# EasyEDA Pro project ProDoc_DRV8701单驱2_2025-04-30.epro

# Schematic SCH-DRV8701E双驱_2
Board Name: DRV8701E双驱_1; Create Date: 2025-01-18; Page Name: P1; Project Name: DRV8701E双驱，曙光; Schematic Name: SCH-DRV8701E双驱_1; Update Date: 2025-01-18; Company: 嘉立创EDA; Page Size: A4; Version: V1.0
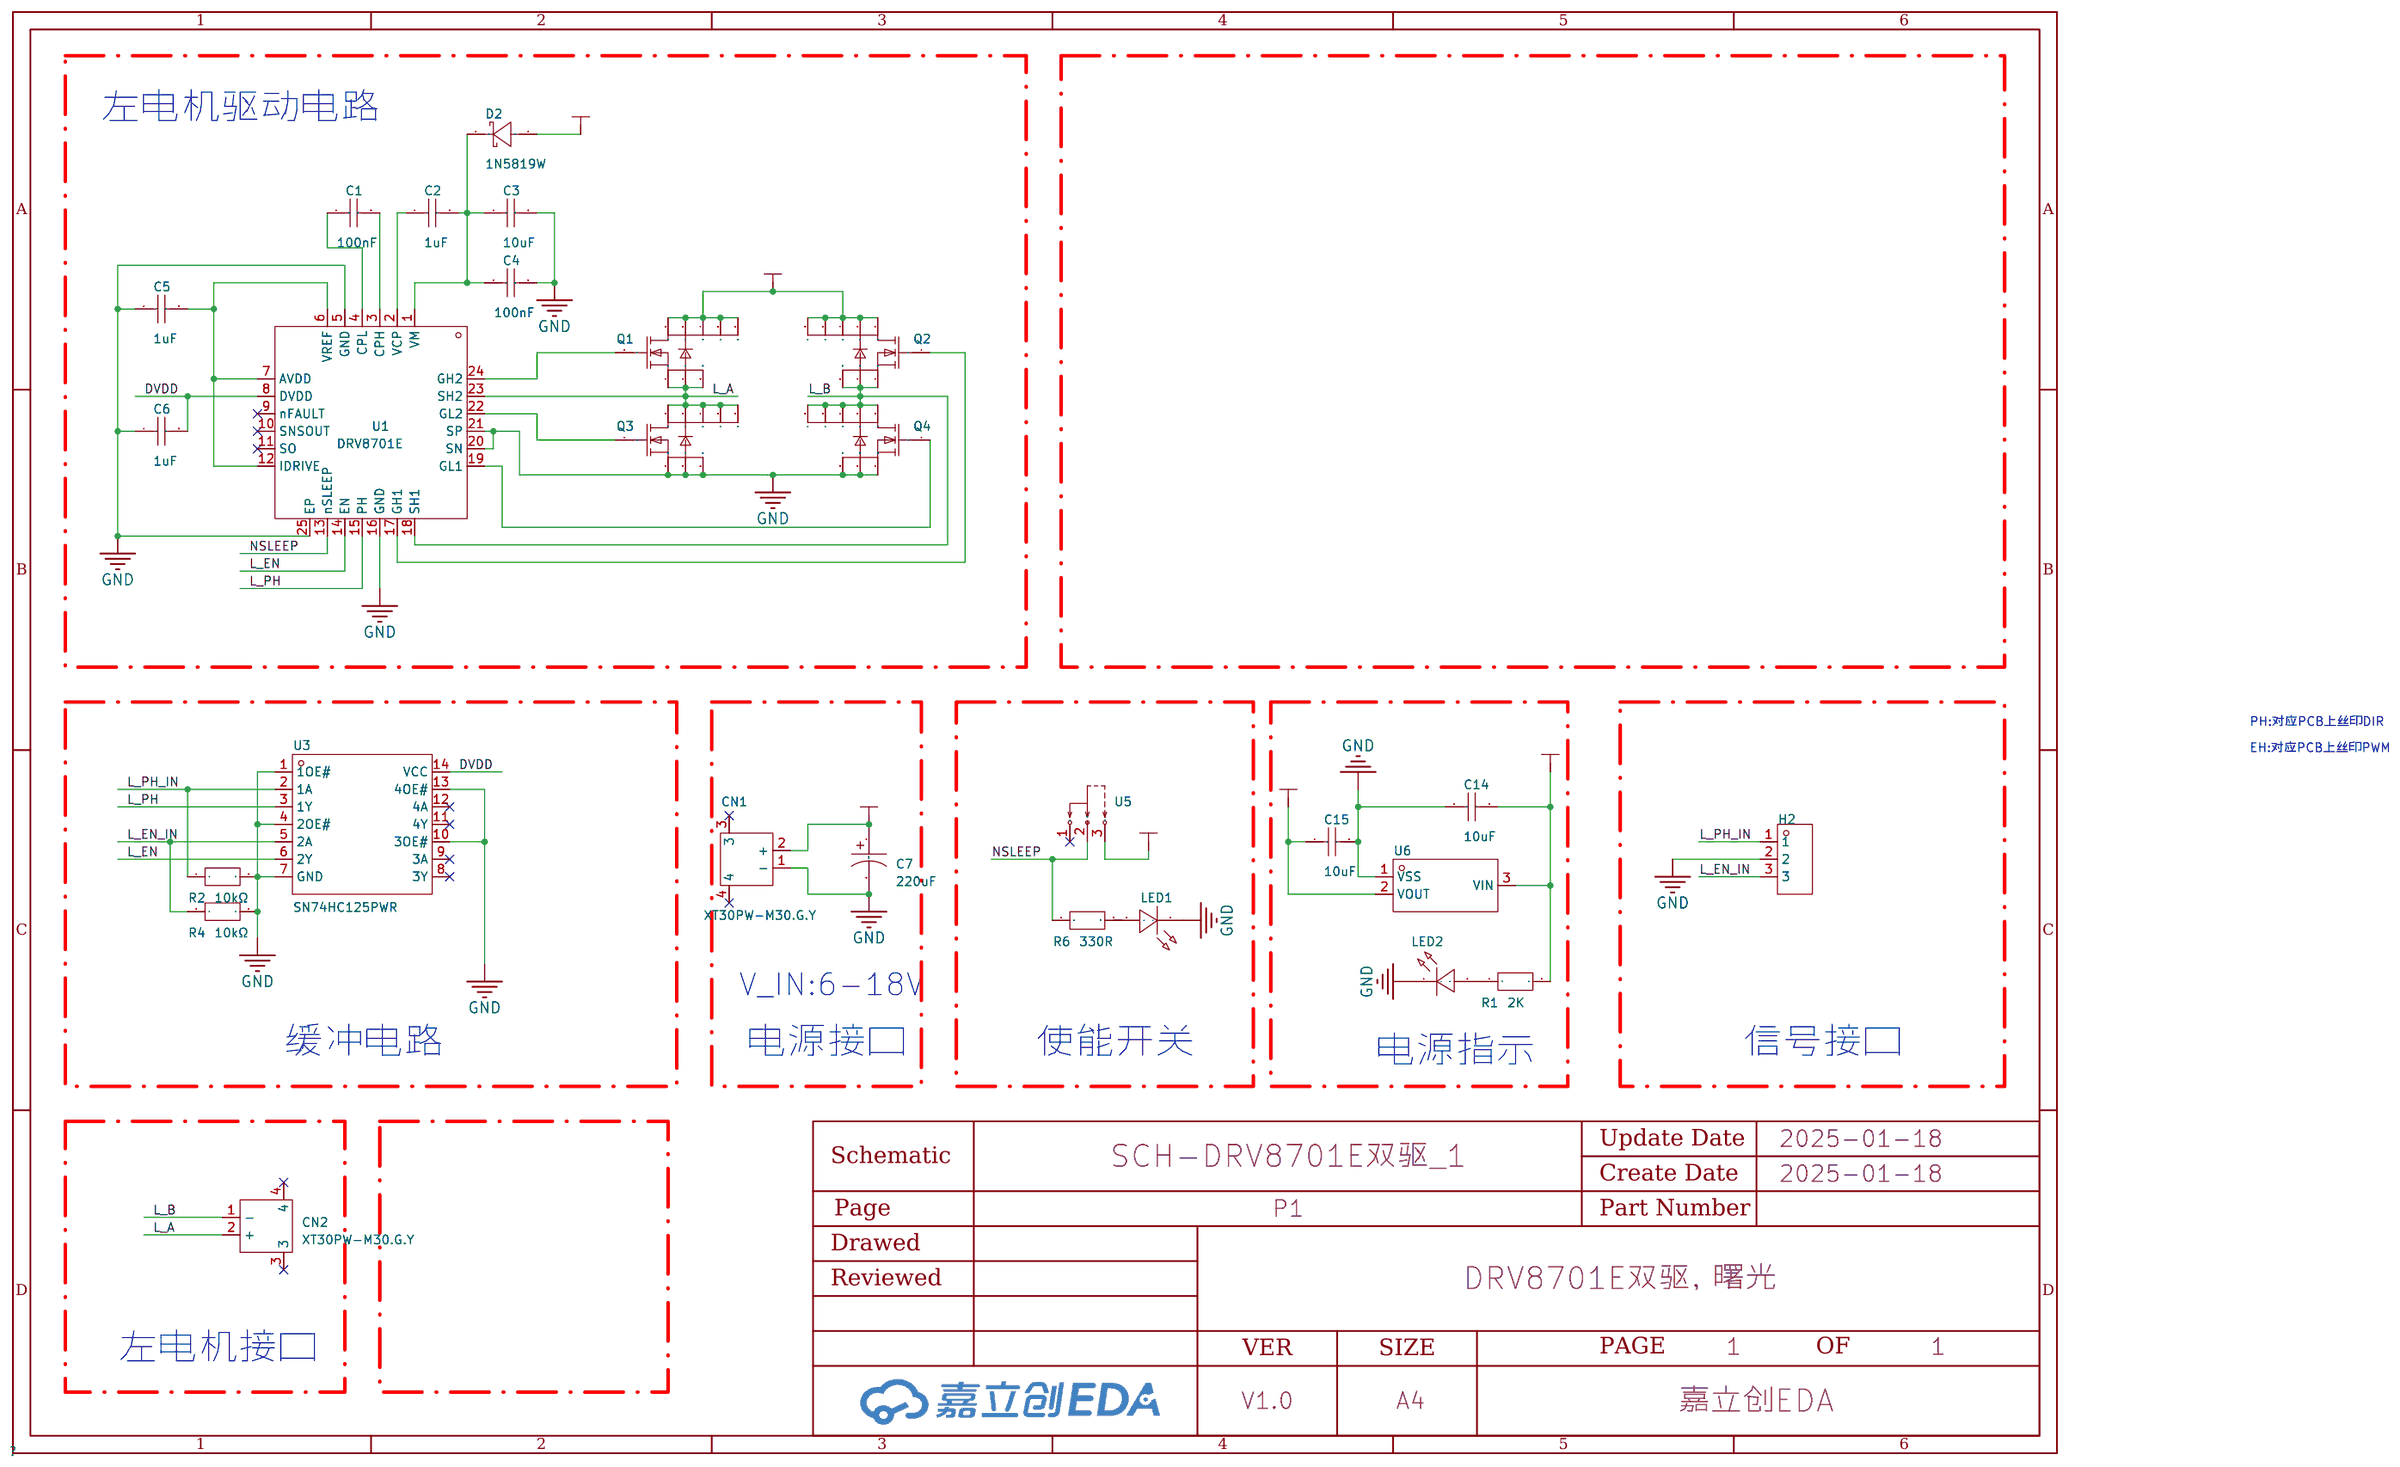
[diagram p0: schematic sheet]

## Parts
C1  100nF  [C0805]
C2  1uF  [C0805]
C3  10uF  [C0805]
C4  100nF  [C0805]
C5  1uF  [C0805]
C6  1uF  [C0805]
C7  220uF  [CAP-TH_BD8.0-P3.50-D0.6-FD]
C14  10uF  [C0805]
C15  10uF  [C0805]
CN1  XT30PW-M30.G.Y  [CONN-TH_XT30PW-M]
CN2  XT30PW-M30.G.Y  [CONN-TH_XT30PW-M]
D2  1N5819W  [SOD-123_L2.7-W1.6-LS3.7-R-RD]
H2  -  [HDR-TH_3P-P2.54-V-F]
LED1  P2-0805UVTCS2-0.8T  [LED0805-RD_PURPLE]
LED2  P2-0805UVTCS2-0.8T  [LED0805-RD_PURPLE]
Q1  TPH1R403NL,L1Q(M  [DSOP-8_L5.0-W5.0-P1.27-LS6.0-BL-EP]
Q2  TPH1R403NL,L1Q(M  [DSOP-8_L5.0-W5.0-P1.27-LS6.0-BL-EP]
Q3  TPH1R403NL,L1Q(M  [DSOP-8_L5.0-W5.0-P1.27-LS6.0-BL-EP]
Q4  TPH1R403NL,L1Q(M  [DSOP-8_L5.0-W5.0-P1.27-LS6.0-BL-EP]
R1  2K  [R0805]
R2  10kΩ  [R0805]
R4  10kΩ  [R0805]
R6  330R  [R0805]
U1  DRV8701E  [VQFN-24_L4.0-W4.0-P0.50-BL-EP2.5]
U3  SN74HC125PWR  [TSSOP-14_L5.0-W4.4-P0.65-LS6.5-BL]
U5  HX SS12D10G4  [SW-TH_SHOU-HAN_SS12D10G4]
U6  LR8341A-T33  [SOT-23-3L_L2.9-W1.6-P1.90-LS2.8-BL]

## Library data of the parts
C1-C6 C14 C15 = CL21B104KBCNNNC: 容值:100nF;精度:±10%;额定电压:50V;材质(温度系数):X7R;; LCSC Part Name: 100nF ±10% 50V; Supplier Part: C1711; Manufacturer: SAMSUNG(三星); Supplier Footprint: 0805; JLCPCB Part Class: Extended Part; Datasheet: https://atta.szlcsc.com/upload/public/pdf/source/20160103/1457707693305.pdf; Supplier: LCSC; Tolerance: ±10%; Voltage Rated: 50V; Temperature Coefficient: X7R
C7 = 25PZE220M8X9: 类型:混合物;容值:220uF;精度:±20%;额定电压:25V;电容体直径:8mm;电容体长度:9mm;脚间距:-;纹波电流:2.3A@100kHz;等效串联电阻:27mΩ@100kHz;工作寿命:10000hrs@105℃;工作温度:-55℃~+105℃;; LCSC Part Name: 220uF ±20% 25V; Supplier Part: C1578758; Manufacturer: rubycon(红宝石); Supplier Footprint: 径向引线,8x9mm; JLCPCB Part Class: Extended Part; Datasheet: https://atta.szlcsc.com/upload/public/pdf/source/20210510/C1578758_E2F1F56A0A42A1F170EC582F74BCA115.pdf; Supplier: LCSC; Type: 混合物; Tolerance: ±20%; Rated Voltage: 25V; φD: 8mm; L: 9mm; Ripple Current: 2.3A@100kHz; Equivalent Series Resistance(ESR): 27mΩ@100kHz; Lifetime @ Temp: 10000hrs@105℃; Operating Temperature: -55℃~+105℃
CN1 CN2 = XT30PW-M30.G.Y: 类别:-;类型1:-;; LCSC Part Name: AMASS(艾迈斯)航模插头 卧式弯脚 XT30PW-M公头; Supplier Part: C431092; Manufacturer: AMASS(艾迈斯); JLCPCB Part Class: 扩展库; Datasheet: https://atta.szlcsc.com/upload/public/pdf/source/20220222/6A9F22F7850E25B33E1BE430ADF8560B.pdf; Supplier: LCSC; Type: 航模插头; RatedVoltage: DC 500V; InterfaceType: 公头; RatedCurrent: 15A; RecommendedWireGauge: 16/18/20AWG; contact resistance: 1.2mΩ; specifications: 2pin
D2 = 1N5819W_C963381: 二极管配置:独立式;直流反向耐压(Vr):40V;平均整流电流(Io):350mA;正向压降(Vf):600mV@200mA;反向电流(Ir):5uA@30V;; LCSC Part Name: 40V 350mA 600mV@200mA; Supplier Part: C963381; Manufacturer: JSMSEMI(杰盛微); Supplier Footprint: SOD-123; JLCPCB Part Class: 扩展库; Datasheet: https://atta.szlcsc.com/upload/public/pdf/source/20211201/C266112E93E924DFE0C071C9A8E85281.pdf; Supplier: LCSC; Diode Configuration: 独立式; Reverse Voltage (Vr): 40V; Average Rectified Current (Io): 350mA; Forward Voltage (Vf@If): 600mV@200mA; Reverse Leakage Current (Ir): 5uA@30V
H2 = HDR-F_2.54_1x3P: Supplier Part: C541850; Supplier Footprint: 插件
LED1 LED2 = P2-0805UVTCS2-0.8T: 峰值波长:410nm~420nm;发光角度:120°;正向电压:3V;正向电流:30mA;功耗:90mW;工作温度:-40℃~+85℃;抗静电能力:2kV;辐射功率:-;; LCSC Part Name: 0805紫光0.8T; Supplier Part: C2827270; Manufacturer: TUOZHAN(拓展光电); Supplier Footprint: 0805; JLCPCB Part Class: 扩展库; Datasheet: https://atta.szlcsc.com/upload/public/pdf/source/20210423/C2827270_475A43B7F06EF651B4600F80B81B4A43.pdf; Supplier: LCSC; Peak Wavelength: 410nm~420nm; Viewing Angle: 120°; Forward Voltage: 3V; Forward Current: 30mA; Power Dissipation: 90mW; Operating Temperature: -40℃~+85℃; Antistatic Ability: 2kV
Q1-Q4 = TPH1R403NL,L1Q(M: Supplier Part: C2940403; Manufacturer: TOSHIBA(东芝); Supplier Footprint: SOP-8; Datasheet: https://atta.szlcsc.com/upload/public/pdf/source/20220830/C277A7BCA37DB7348B2C95BA2E6DA6BE.pdf; Supplier: LCSC
R1 R2 R4 R6 = ERJP06J103V: 阻值:10kΩ;精度:±5%;功率:500mW;温度系数:±200ppm/℃;最大工作电压:600V;工作温度范围:-55℃~+155℃;; LCSC Part Name: 10kΩ ±5% 500mW; Supplier Part: C441955; Manufacturer: PANASONIC(松下); Supplier Footprint: 0805; JLCPCB Part Class: Extended Part; Supplier: LCSC; Tolerance: ±5%; Power(Watts): 500mW; Temperature Coefficient: ±200ppm/℃; Overload Voltage (Max): 600V; Operating Temperature Range: -55℃~+155℃
U1 = DRV8701ERGET: 电源电压:0V~5.5V;输出电流:-;接口:并行;; Supplier Part: C132049; Manufacturer: TI(德州仪器); Supplier Footprint: VQFN-24(4x4); JLCPCB Part Class: Extended Part; Datasheet: https://atta.szlcsc.com/upload/public/pdf/source/20170925/C132049_1506321643935990409.pdf; Supplier: LCSC; Type: 有刷直流电机; Supply Voltage: 0V~5.5V; Interface: 并行; Operating Temperature: -40℃~+125℃@(Ta)
U3 = SN74HC125PWR: 类型:缓冲器，非反相;电源电压:2V~6V;输入类型:-;输出类型:三态;低电平输出电流(IOL):7.8mA;高电平输出电流(IOH):7.8mA;工作温度:-40℃~+85℃;; Supplier Part: C132994; Manufacturer: TI(德州仪器); Supplier Footprint: TSSOP-14; JLCPCB Part Class: Extended Part; Datasheet: https://atta.szlcsc.com/upload/public/pdf/source/20170930/C132994_1506736365150997346.pdf; Supplier: LCSC; Type: 缓冲器，非反相; Supply Voltage: 2V~6V; output type: 三态; Current-OutputLow: 7.8mA; Current-OutputHigh: 7.8mA; Operating temperature: -40℃~+85℃
U5 = HX SS12D10G4: LCSC Part Name: 拨动开关 立式两档拨动,单排3脚插件,12.7x6.7x6.4,黑柄4mm; Supplier Part: C5149841; Manufacturer: hanxia(韩下); Supplier Footprint: DIP; JLCPCB Part Class: 扩展库; Datasheet: https://atta.szlcsc.com/upload/public/pdf/source/20220907/2020D7183ED16DD6E2B9F5A13FB144CF.pdf; Supplier: LCSC
U6 = LR8341A-T33: 输出类型:固定;输出极性:正;输出通道数:1;最大输入电压:40V;输出电压:3.3V;压差:-;静态电流(地电流):2uA;输出电流:100mA;电源纹波抑制比(PSRR):55dB@(1kHz);噪声:-;特性:-;工作温度:-40℃~+85℃;; LCSC Part Name: 正 Vin=40V Vout=3.3V 100mA 55dB@(1kHz); Supplier Part: C2829465; Manufacturer: LR(朗瑞); Supplier Footprint: SOT-23-3L; JLCPCB Part Class: 扩展库; Datasheet: https://atta.szlcsc.com/upload/public/pdf/source/20210426/C2829465_61F15D7ACE9671B48D4F69A8092B0D8F.pdf; Supplier: LCSC; Output Type: 固定; Output Polarity: 正; Number of Outputs: 1; Maximum Input Voltage: 40V; Output Voltage: 3.3V; Quiescent Current (Ground Current): 2uA; Output Current: 100mA; Power Supply Rejection Ratio (PSRR): 55dB@(1kHz); Operating Temperature: -40℃~+85℃

## Nets
3V3: C15.1 U5.3 U6.2(VOUT)
DVDD: C6.2 U1.8(DVDD) U3.14(VCC)
GND: C3.2 C4.2 C5.1 C6.1 C7.2 C14.1 C15.2 CN1.1(-) H2.2 LED1.1(-) LED2.1(-) Q3.1(S) Q3.2(S) Q3.3(S) Q4.1(S) Q4.2(S) Q4.3(S) R2.2 R4.2 U1.5(GND) U1.16(GND) U1.20(SN) U1.21(SP) U1.25(EP) U3.1(1OE#) U3.4(2OE#) U3.7(GND) U3.10(3OE#) U3.13(4OE#) U6.1(VSS)
L_A: CN2.2(+) Q1.1(S) Q1.2(S) Q1.3(S) Q3.5(D) Q3.6(D) Q3.7(D) Q3.8(D) Q3.9(D) U1.23(SH2)
L_B: CN2.1(-) Q2.1(S) Q2.2(S) Q2.3(S) Q4.5(D) Q4.6(D) Q4.7(D) Q4.8(D) Q4.9(D) U1.18(SH1)
L_EN: U1.14(EN) U3.6(2Y)
L_EN_IN: H2.3 R4.1 U3.5(2A)
L_PH: U1.15(PH) U3.3(1Y)
L_PH_IN: H2.1 R2.1 U3.2(1A)
NSLEEP: R6.1 U1.13(nSLEEP) U5.2
VM: C7.1 C14.2 CN1.2(+) D2.1(A) Q1.5(D) Q1.6(D) Q1.7(D) Q1.8(D) Q1.9(D) Q2.5(D) Q2.6(D) Q2.7(D) Q2.8(D) Q2.9(D) R1.2 U6.3(VIN)
$1N1474: C2.2 C3.1 C4.1 D2.2(C) U1.1(VM)
$1N1596: C2.1 U1.2(VCP)
$1N1619: C1.2 U1.3(CPH)
$1N1625: C1.1 U1.4(CPL)
$1N1654: C5.2 U1.6(VREF) U1.7(AVDD) U1.12(IDRIVE)
$1N3164: Q1.4(G) U1.24(GH2)
$1N3182: Q3.4(G) U1.22(GL2)
$1N4098: Q4.4(G) U1.19(GL1)
$1N4838: Q2.4(G) U1.17(GH1)
$1N20971: LED1.2(+) R6.2
$1N38710: LED2.2(+) R1.1

Not connected (* = marked no-connect by the designer): CN1 3* 4*; CN2 3* 4*; U1 9(nFAULT)* 10(SNSOUT)* 11(SO)*; U3 8(3Y)* 9(3A)* 11(4Y)* 12(4A)*; U5 1*

## Notes on the sheet
- 左电机驱动电路
- PH:对应PCB上丝印DIR
- EH:对应PCB上丝印PWM
- V_IN:6-18V
- 缓冲电路
- 电源接口
- 使能开关
- 电源指示
- 信号接口
- 左电机接口

# Board PCB-DRV8701E双驱_2
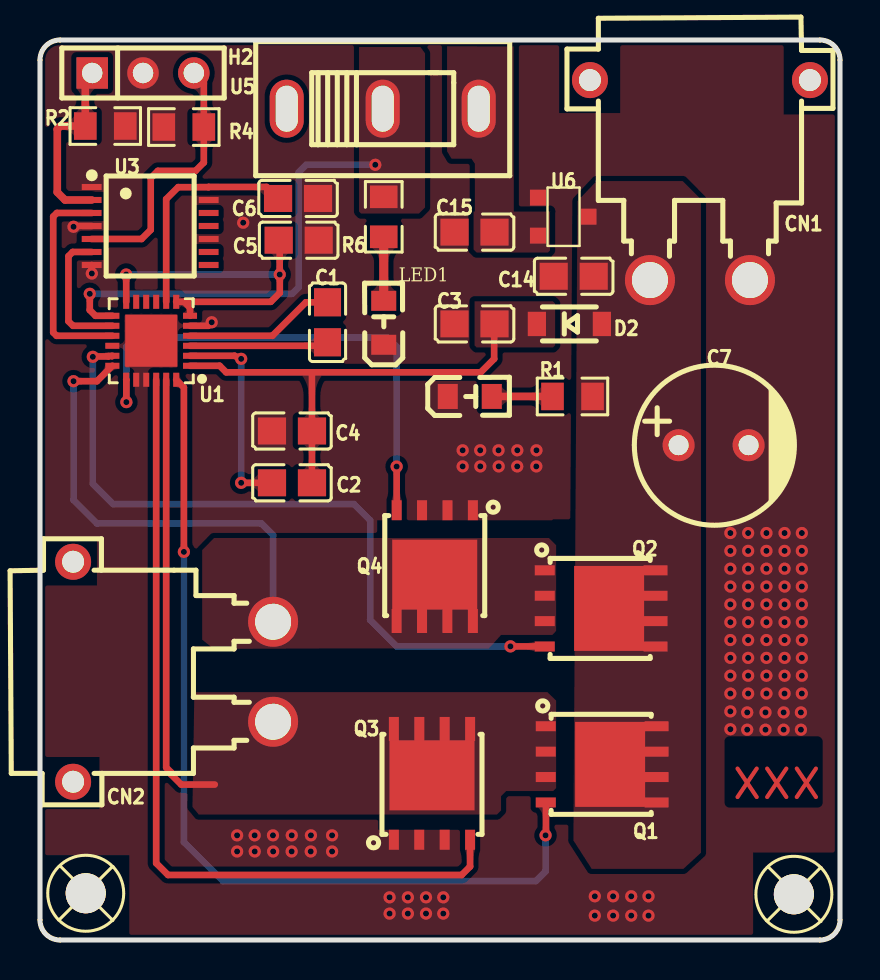
[diagram p1: board, top side]
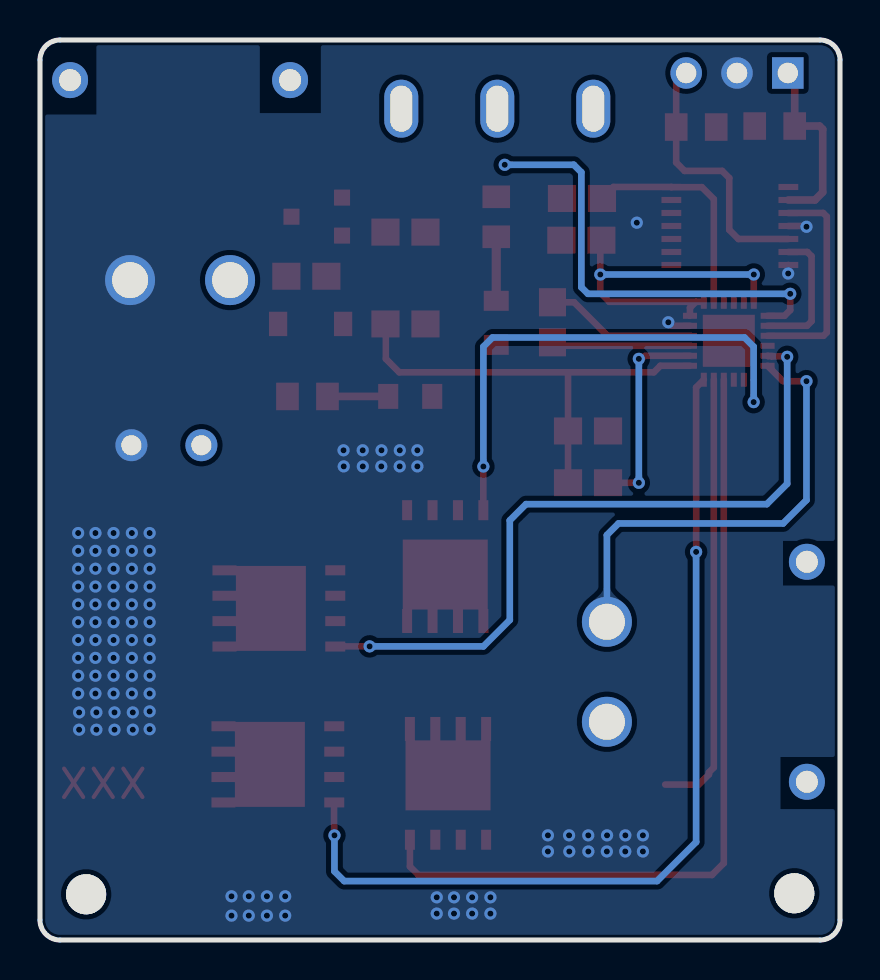
[diagram p2: board, bottom side, seen from below]

Outline 40 x 45 mm; copper layers: Top Layer, Bottom Layer. Coordinates in mm from the lower left corner of the outline.
Outline path: 0,44 0,1 arc(0.29,0.29) 1,0 39,0 arc(39.71,0.29) 40,1 40,44 arc(39.71,44.71) 39,45 1,45 arc(0.29,44.71) 0,44
Stack: Top Layer 0.035mm / Dielectric1 1.51mm FR4 er 4.5 / Bottom Layer 0.035mm

## Design rules (mm)
template: 用户自定义配置
spacing safeClearance (default): track to track 0.152, other pairs 0.152 to 0.3
track width trackWidth (default): min 0.33, default 0.33, max 2.54
differential pair differentialPair (default): width min 0.127, default 0.254, max 2.54; gap min 0.152, default 0.152
via viaSize (default): diameter min 0.5, default 0.61, max 10; hole min 0.3, default 0.305, max 5.999
net GND uses copperRegion2
net VM uses copperRegion2

## Placement (name value [footprint] x y rotation side)
C1  100nF  [C0805]  14.38 30.89 270 top
C2  1uF  [C0805]  12.6 22.86 0 top
C3  10uF  [C0805]  21.73 30.8 180 top
C4  100nF  [C0805]  12.6 25.45 180 top
C5  1uF  [C0805]  12.93 34.99 180 top
C6  1uF  [C0805]  12.9 37.08 180 top
C7  220uF  [CAP-TH_BD8.0-P3.50-D0.6-FD]  33.68 24.74 0 top
C14  10uF  [C0805]  26.68 33.19 0 top
C15  10uF  [C0805]  21.73 35.39 180 top
CN1  XT30PW-M30.G.Y  [CONN-TH_XT30PW-M]  33 38 180 top
CN2  XT30PW-M30.G.Y  [CONN-TH_XT30PW-M]  6.66 13.41 270 top
D2  1N5819W  [SOD-123_L2.7-W1.6-LS3.7-R-RD]  26.47 30.8 0 top
H2  -  [HDR-TH_3P-P2.54-V-F]  5.15 43.35 0 top
LED1  P2-0805UVTCS2-0.8T  [LED0805-RD_PURPLE]  17.19 30.86 90 top
LED2  P2-0805UVTCS2-0.8T  [LED0805-RD_PURPLE]  21.49 27.18 0 top
Q1  TPH1R403NL,L1Q(M  [DSOP-8_L5.0-W5.0-P1.27-LS6.0-BL-EP]  28.06 8.78 270 top
Q2  TPH1R403NL,L1Q(M  [DSOP-8_L5.0-W5.0-P1.27-LS6.0-BL-EP]  28.01 16.58 270 top
Q3  TPH1R403NL,L1Q(M  [DSOP-8_L5.0-W5.0-P1.27-LS6.0-BL-EP]  19.6 7.78 0 top
Q4  TPH1R403NL,L1Q(M  [DSOP-8_L5.0-W5.0-P1.27-LS6.0-BL-EP]  19.74 18.72 180 top
R1  2K  [R0805]  26.63 27.18 0 top
R2  10kΩ  [R0805]  3.26 40.7 0 top
R4  10kΩ  [R0805]  7.19 40.65 180 top
R6  330R  [R0805]  17.19 36.16 270 top
SCREW1  -  [M2螺丝]  2.29 2.34 0 top
SCREW2  -  [M2螺丝]  37.69 2.29 0 top
U1  DRV8701E  [VQFN-24_L4.0-W4.0-P0.50-BL-EP2.5]  5.56 29.96 90 top
U3  SN74HC125PWR  [TSSOP-14_L5.0-W4.4-P0.65-LS6.5-BL]  5.51 35.7 270 top
U5  HX SS12D10G4  [SW-TH_SHOU-HAN_SS12D10G4]  17.14 41.57 0 top
U6  LR8341A-T33  [SOT-23-3L_L2.9-W1.6-P1.90-LS2.8-BL]  26.16 36.17 270 top

## Footprints (pads in the part's own frame, mm; a bottom-side part is the same pattern mirrored in y, then rotated)
C0805
  rect 1.41x1.35 smd: 1(-1,0) 2(1,0)
CAP-TH_BD8.0-P3.50-D0.6-FD
  round 1.6 hole 1: 1(-1.75,0) 2(1.75,0)
CONN-TH_XT30PW-M
  round 2.5 hole 1.8: 1(-2.5,5) 2(2.5,5)
  round 1.8 hole 1.1: 3(5.5,-5) 4(-5.5,-5)
DSOP-8_L5.0-W5.0-P1.27-LS6.0-BL-EP
  rect 0.5x1 smd: 1(-1.905,-2.77) 2(-0.635,-2.77) 3(0.634,-2.77) 4(1.905,-2.77)
  rect 0.5x1.2 smd: 5(1.905,2.77) 6(0.635,2.77) 7(-0.634,2.77) 8(-1.905,2.77)
  custom 4.25x3.5 smd: 9(0,0.45)
HDR-TH_3P-P2.54-V-F
  rect 1.575x1.575 hole 1.02: 1(-2.54,0)
  round 1.575 hole 1.02: 2(0,0) 3(2.54,0)
LED0805-RD_PURPLE
  rect 1.001x1.25 smd: 1(-1.1,0) 2(1.1,0)
M2螺丝
  round 2 hole 2: 1(0,0)
R0805
  rect 1.133x1.377 smd: 1(-1,0) 2(1,0)
SOD-123_L2.7-W1.6-LS3.7-R-RD
  rect 0.909x1.219 smd: 1(1.625,0) 2(-1.625,0)
SOT-23-3L_L2.9-W1.6-P1.90-LS2.8-BL
  rect 0.8x0.8 smd: 1(-0.95,-1.265) 2(0.95,-1.265) 3(0.005,1.265)
SW-TH_SHOU-HAN_SS12D10G4
  oval 1.7x2.9 hole 1.1x2.3: 1(-4.8,0) 2(0,0) 3(4.8,0)
TSSOP-14_L5.0-W4.4-P0.65-LS6.5-BL
  rect 0.305x0.991 smd: 1(-1.95,-2.925) 2(-1.3,-2.925) 3(-0.65,-2.925) 4(0,-2.925) 5(0.65,-2.925) 6(1.3,-2.925) 7(1.95,-2.925) 8(1.95,2.925) 9(1.3,2.925) 10(0.65,2.925) 11(0,2.925) 12(-0.65,2.925) 13(-1.3,2.925) 14(-1.95,2.925)
VQFN-24_L4.0-W4.0-P0.50-BL-EP2.5
  rect 0.3x0.7 smd: 1(-1.25,-1.942) 2(-0.75,-1.942) 3(-0.25,-1.942) 4(0.25,-1.942) 5(0.75,-1.942) 6(1.25,-1.942) 13(1.25,1.942) 14(0.75,1.942) 15(0.25,1.942) 16(-0.25,1.942) 17(-0.75,1.942) 18(-1.25,1.942)
  rect 0.7x0.3 smd: 7(1.948,-1.25) 8(1.948,-0.75) 9(1.948,-0.25) 10(1.948,0.25) 11(1.948,0.75) 12(1.948,1.25) 19(-1.948,1.25) 20(-1.948,0.75) 21(-1.948,0.25) 22(-1.948,-0.25) 23(-1.948,-0.75) 24(-1.948,-1.25)
  rect 2.6x2.6 smd: 25(0.001,-0.001)

## Nets
As in the schematic.

Pads without a net: CN1 3 4; CN2 3 4; SCREW1 1; SCREW2 1; U1 9 10 11; U3 8 9 11 12; U5 1

## Via types
v1: diameter 0.61, hole 0.305, Top Layer to Bottom Layer, 115 vias

## Routing (per net, layer and track width the routed paths; a pad name or vN(x,y) marks a point on that pad's centre or on a via; arc(x,y) is an arc through that point)
DVDD: length 11.2
  Top Layer w0.33: C6.2 11.33,37.65 8.43,37.65 8.43,37.64 6.91,37.64 6.31,37.04 U1.8
GND: length 2.5
  Top Layer w0.33: U3.7 2.58,33.33 v1(2.59,33.33) ; v1(1.68,35.66) 1.72,35.7 U3.4 ; U1.5 8.41,30.71 v1(8.59,30.89)
  vias: v1(9.85,5.23) v1(9.85,4.43) v1(10.16,35.86) v1(10.73,5.23) v1(10.74,4.43) v1(11.65,5.23) v1(11.66,4.43) v1(12.59,5.23) v1(12.58,4.43) v1(13.55,5.23) v1(13.54,4.43) v1(14.6,5.23) v1(14.6,4.43) v1(17.48,2.13) v1(17.48,1.32) v1(18.39,2.13) v1(18.39,1.32) v1(19.3,2.13) v1(19.3,1.32) v1(20.16,2.13) v1(20.16,1.32) v1(21.13,24.49) v1(21.13,23.68) v1(22.01,24.49) v1(22.01,23.68) v1(22.93,24.49) v1(22.94,23.68) v1(23.87,24.49) v1(23.86,23.68) v1(24.82,24.49) v1(24.81,23.68) v1(27.74,2.18) v1(27.74,1.22) v1(28.66,2.18) v1(28.66,1.22) v1(29.56,2.18) v1(29.56,1.22) v1(30.43,2.18) v1(30.43,1.22) v1(34.52,20.35) v1(34.52,19.46) v1(34.52,18.56) v1(34.52,17.67) v1(34.52,16.78) v1(34.52,15.89) v1(34.52,15) v1(34.52,14.11) v1(34.52,13.21) v1(34.52,12.32) v1(34.52,11.43) v1(34.52,10.54) v1(35.41,20.35) v1(35.41,19.46) v1(35.41,18.56) v1(35.41,17.67) v1(35.41,16.78) v1(35.41,15.89) v1(35.41,15) v1(35.41,14.11) v1(35.41,13.21) v1(35.41,12.32) v1(35.36,11.38) v1(35.36,10.52) v1(36.32,20.35) v1(36.32,19.46) v1(36.32,18.56) v1(36.32,17.67) v1(36.32,16.78) v1(36.32,15.89) v1(36.32,15) v1(36.32,14.11) v1(36.32,13.21) v1(36.32,12.32) v1(36.28,11.38) v1(36.28,10.52) v1(37.23,20.35) v1(37.23,19.46) v1(37.23,18.56) v1(37.23,17.67) v1(37.23,16.78) v1(37.23,15.89) v1(37.23,15) v1(37.23,14.11) v1(37.23,13.21) v1(37.23,12.32) v1(37.18,11.38) v1(37.18,10.52) v1(38.04,11.38) v1(38.04,10.52) v1(38.09,20.35) v1(38.09,19.46) v1(38.09,18.56) v1(38.09,17.67) v1(38.09,16.78) v1(38.09,15.89) v1(38.09,15) v1(38.09,14.11) v1(38.09,13.21) v1(38.09,12.32)
L_A: length 22.2
  Top Layer w0.33: U1.23 6.31,8.63 6.55,8.38 6.55,8.28 7.06,7.77 8.74,7.77
L_B: length 23.2
  Top Layer w0.33: v1(1.68,27.94) 2.85,27.94 U1.18
  Bottom Layer w0.33: v1(1.68,27.94) 1.68,22 2.84,20.83 11.07,20.83 11.66,20.25 CN2.1
L_EN: length 6.8
  Top Layer w0.33: U1.14 1.65,30.71 1.42,30.94 1.42,34.19 1.63,34.4 U3.6
L_EN_IN: length 13.4
  Top Layer w0.33: U3.5 5.08,35.05 5.54,35.51 5.54,38.1 5.89,38.46 7.77,38.46 8.19,38.87 R4.1 8.19,42.85 H2.3
L_PH: length 10.8
  Top Layer w0.33: U1.15 0.83,30.21 0.66,30.38 0.66,36.17 0.84,36.35 U3.3
L_PH_IN: length 9.3
  Top Layer w0.381: H2.1 2.26,43 R2.1 1.02,40.7 0.86,40.54 0.86,37.39 1.25,37 U3.2
NSLEEP: length 22.4
  Top Layer w0.33: v1(2.49,32.31) 2.49,31.5 2.77,31.21 U1.13
  Bottom Layer w0.33: v1(16.76,38.76) 13.31,38.76 12.93,38.38 12.93,32.64 12.6,32.31 v1(2.49,32.31)
$1N1474: length 22.9
  Top Layer w0.33: C2.2 C4.1 13.6,28.37 13.62,28.39 ; 13.62,28.39 22.03,28.39 22.71,29.06 22.71,30.79 C3.1 ; 13.62,28.39 9.31,28.39 8.98,28.71 U1.1
$1N1596: length 10.3
  Top Layer w0.33: C2.1 v1(10.06,22.86) ; U1.2 9.73,29.21 v1(10.06,29.06)
  Bottom Layer w0.33: v1(10.06,29.06) v1(10.06,22.86)
$1N1619: length 6.9
  Top Layer w0.33: C1.2 14.2,29.71 U1.3
$1N1625: length 7.6
  Top Layer w0.33: U1.4 11.62,30.21 13.29,31.89 C1.1
$1N1654: length 17.9
  Top Layer w0.33: 7.21,31.91 11.54,31.91 11.99,32.36 11.99,33.27 v1(11.98,33.27) 11.98,34.94 C5.2 ; 7.21,31.91 7.5,31.61 U1.6 ; 7.21,31.91 U1.7 ; U1.12 v1(4.31,33.27)
  Bottom Layer w0.33: v1(11.98,33.27) v1(4.31,33.27)
$1N3164: length 45.8
  Top Layer w0.33: U1.24 7.19,27.63 v1(7.19,19.41) ; v1(25.28,5.23) 25.3,5.25 25.3,6.87 Q1.4
  Bottom Layer w0.33: v1(25.28,5.23) 25.28,3.43 24.79,2.95 9.14,2.95 7.19,4.9 v1(7.19,19.41)
$1N3182: length 41.6
  Top Layer w0.33: U1.22 5.81,3.84 6.4,3.25 21.08,3.25 21.5,3.67 Q3.4
$1N4098: length 26
  Top Layer w0.33: v1(17.83,23.67) 17.83,23.67 Q4.4 ; U1.19 4.32,28 v1(4.32,26.89)
  Bottom Layer w0.33: v1(4.32,26.89) 4.32,29.67 4.78,30.12 17.37,30.12 17.83,29.67 v1(17.83,23.67)
$1N4838: length 36.2
  Top Layer w0.33: U1.17 3.6,29.19 3.42,29.19 3.4,29.18 2.66,29.18 v1(2.64,29.16) ; Q2.4 25.23,14.68 v1(23.52,14.68)
  Bottom Layer w0.33: v1(23.52,14.68) 17.83,14.68 16.51,16 16.51,20.98 15.7,21.79 3.66,21.79 2.64,22.81 v1(2.64,29.16)
$1N20971: length 3.2
  Top Layer w0.457: R6.2 LED1.2
$1N38710: length 3
  Top Layer w0.381: LED2.2 25.62,27.18

## Copper pours and planes (outline as drawn; the poured copper is in the pictures)
3V3 on Top Layer: 21.68,36.42 25.5,36.42 25.5,34.37 21.68,34.37
3V3 on Top Layer: 20.35,44.69 23.69,44.69 23.69,34.49 20.35,34.49
GND on Top Layer: -2.54,48.26 43.64,48.26 43.64,-3.2 -2.54,-3.2
GND on Bottom Layer: -1.83,47.04 41.2,47.04 41.2,-1.17 -1.83,-1.17
L_A on Top Layer: 7.62,12.39 25.81,12.39 25.81,6.27 7.62,6.27
L_B on Top Layer: 8.11,20.1 25.81,20.1 25.81,14.55 8.11,14.55
NSLEEP on Top Layer: 15.95,44.65 19.25,44.65 19.25,36.32 15.95,36.32
VM on Top Layer: 26.67,37.95 33.05,37.95 33.05,3.56 26.67,3.56
$1N1474 on Top Layer: 21.73,31.93 25.76,31.93 25.76,29.63 21.73,29.63

Small or netless copper shapes (teardrops, artwork), in the pictures only: 47 on Top Layer, 14 on Bottom Layer

## Text on the board
Top Layer: xxx
Top Solder Mask Layer: 辽宁工程技术大学 | 2025年2月14日 | SCR初音大队
